# EAGLE design simple-se (EAGLE 6.1)

## Sheet 1 of 3
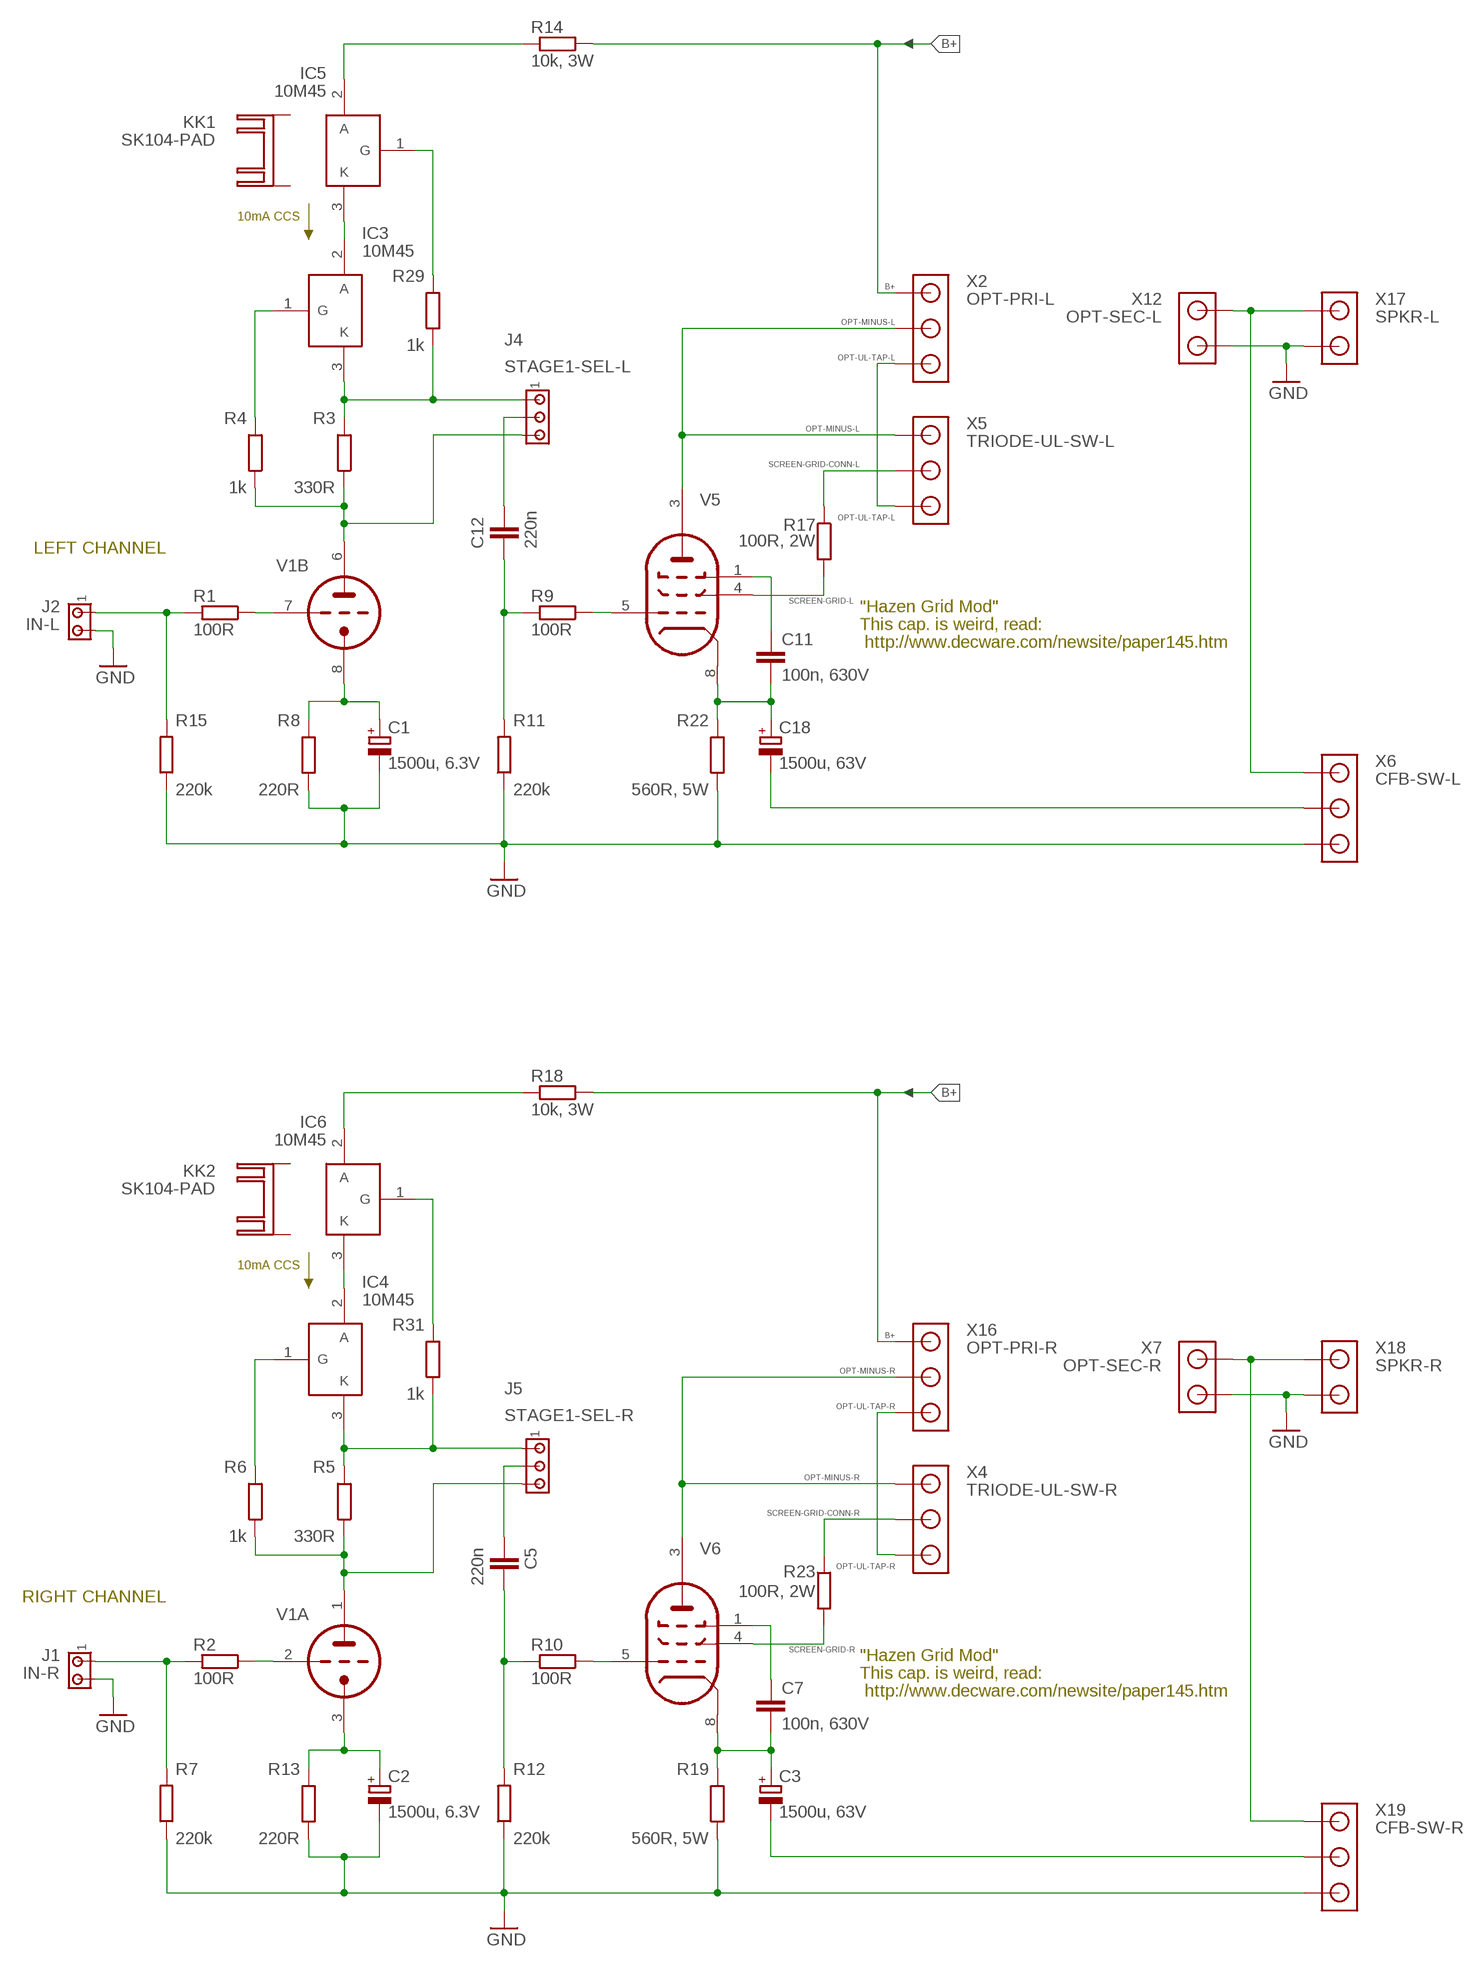
[diagram p0: schematic, sheet 1, part 1 of 2]
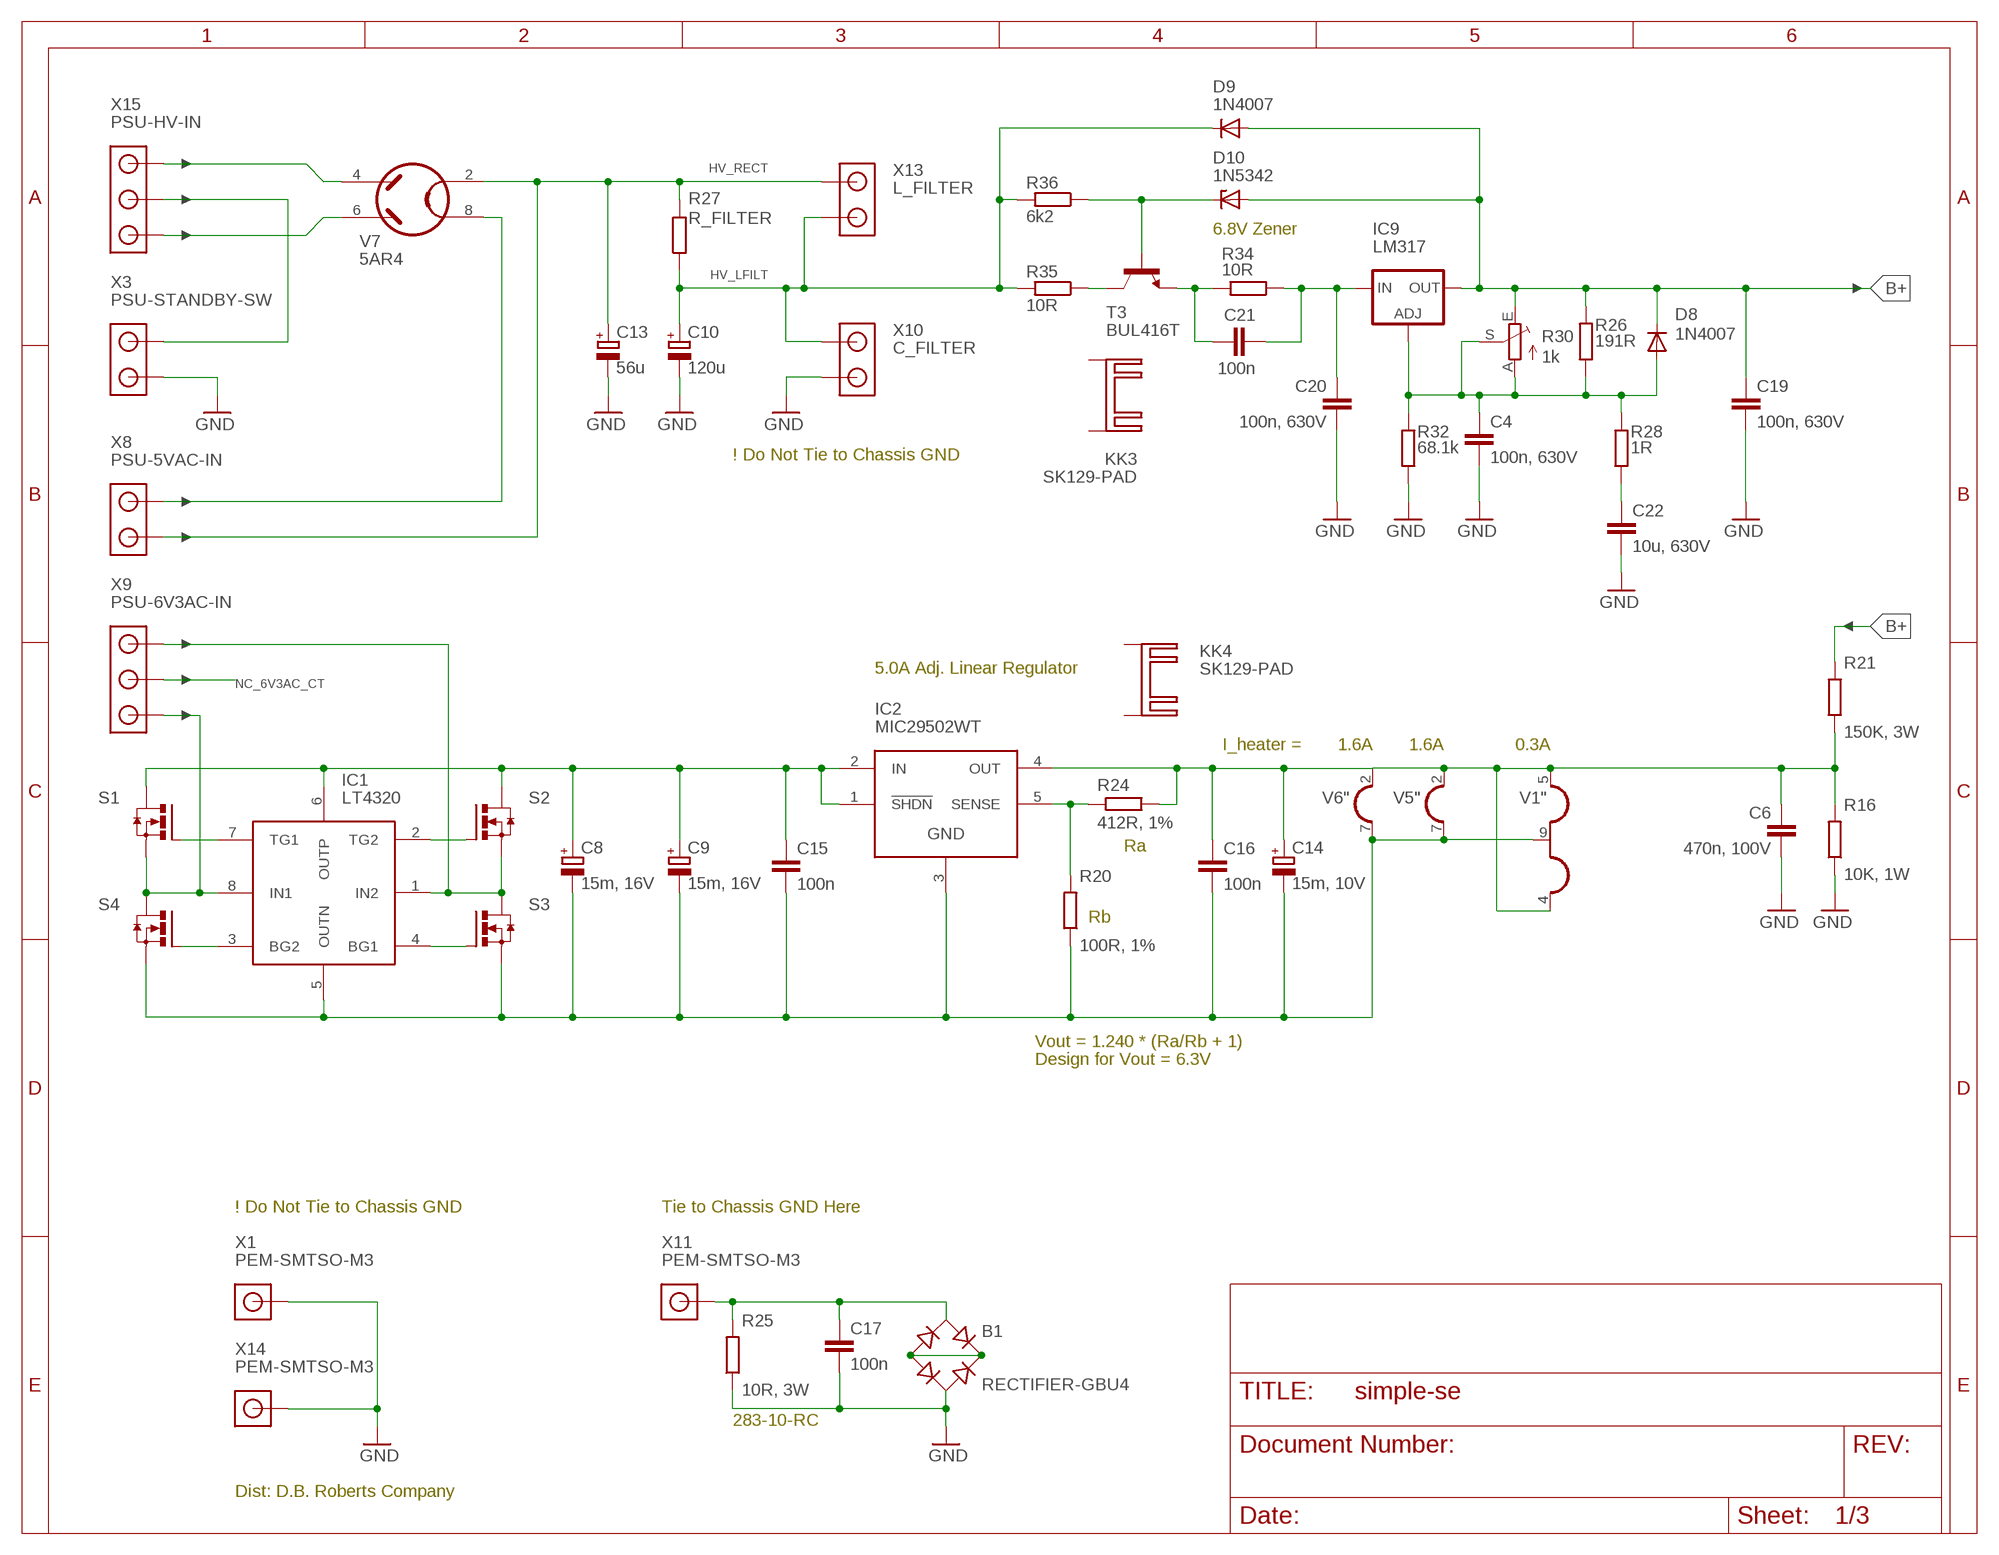
[diagram p1: schematic, sheet 1, part 2 of 2]

### Parts
B1  RECTIFIER-GBU4  [GBU4]
C1  1500u, 6.3V  CPOL-EUE5-10.5  [E5-10,5]
C2  1500u, 6.3V  CPOL-EUE5-10.5  [E5-10,5]
C3  1500u, 63V  CPOL-EUE5-13  [E5-13]
C4  100n, 630V  C-EU150-072X183  [C150-072X183]
C5  220n  C-EU275-113X316  [C275-113X316]
C6  470n, 100V  C-EU075-063X106  [C075-063X106]
C7  100n, 630V  C-EU150-072X183  [C150-072X183]
C8  15m, 16V  CPOL-EUE7.5-18  [E7,5-18]
C9  15m, 16V  CPOL-EUE7.5-18  [E7,5-18]
C10  120u  CPOL-EUE10-30  [EB30D]
C11  100n, 630V  C-EU150-072X183  [C150-072X183]
C12  220n  C-EU275-113X316  [C275-113X316]
C13  56u  CPOL-EUE10-22.5  [EB22,5D]
C14  15m, 10V  CPOL-EUE7.5-18  [E7,5-18]
C15  100n  C-EU050-055X075  [C050-055X075]
C16  100n  C-EU050-055X075  [C050-055X075]
C17  100n  C-EU102-043X133  [C102-043X133]
C18  1500u, 63V  CPOL-EUE5-13  [E5-13]
C19  100n, 630V  C-EU150-072X183  [C150-072X183]
C20  100n, 630V  C-EU150-072X183  [C150-072X183]
C21  100n  C-EU150-072X183  [C150-072X183]
C22  10u, 630V  C-EU150-072X183  [C150-072X183]
D8  1N4007  1N4004  [DO41-10]
D9  1N4007  1N4004  [DO41-10]
D10  1N5342  ZENER-DIODEDO35Z10  [DO35Z10]
IC1  LT4320  [DIL08]
IC2  MIC29502WT  [TO220-5]
IC3  10M45  10M45V  [TO220V]
IC4  10M45  10M45V  [TO220V]
IC5  10M45  10M45V  [TO220V]
IC6  10M45  10M45V  [TO220V]
IC9  LM317  LM317TS  [317TS]
J1  IN-R  MTA02-156  [1X2MTA]
J2  IN-L  MTA02-156  [1X2MTA]
J4  STAGE1-SEL-L  MTA03-156  [1X3MTA]
J5  STAGE1-SEL-R  MTA03-156  [1X3MTA]
KK1  SK104-PAD  [SK104-PAD]
KK2  SK104-PAD  [SK104-PAD]
KK3  SK129-PAD  [SK129]
KK4  SK129-PAD  [SK129]
R1  100R  R-EU_0309/12  [0309/12]
R2  100R  R-EU_0309/12  [0309/12]
R3  330R  R-EU_0309/12  [0309/12]
R4  1k  R-EU_0309/12  [0309/12]
R5  330R  R-EU_0309/12  [0309/12]
R6  1k  R-EU_0309/12  [0309/12]
R7  220k  R-EU_0309/12  [0309/12]
R8  220R  R-EU_0309/12  [0309/12]
R9  100R  R-EU_0309/12  [0309/12]
R10  100R  R-EU_0309/12  [0309/12]
R11  220k  R-EU_0309/12  [0309/12]
R12  220k  R-EU_0309/12  [0309/12]
R13  220R  R-EU_0309/12  [0309/12]
R14  10k, 3W  R-EU_0617/22  [0617/22]
R15  220k  R-EU_0309/12  [0309/12]
R16  10K, 1W  R-EU_0309/12  [0309/12]
R17  100R, 2W  R-EU_0411/12  [0411/12]
R18  10k, 3W  R-EU_0617/22  [0617/22]
R19  560R, 5W  R-EU_0922/22  [0922/22]
R20  100R, 1%  R-EU_0309/12  [0309/12]
R21  150K, 3W  R-EU_0617/22  [0617/22]
R22  560R, 5W  R-EU_0922/22  [0922/22]
R23  100R, 2W  R-EU_0411/12  [0411/12]
R24  412R, 1%  R-EU_0309/12  [0309/12]
R25  10R, 3W  R-EU_0617/17  [0617/17]
R26  191R  R-EU_0309/12  [0309/12]
R27  R_FILTER  R-EU_0922/22  [0922/22]
R28  1R  R-EU_0309/12  [0309/12]
R29  1k  R-EU_0309/12  [0309/12]
R30  1k  TRIM_EU-S64W  [S64W]
R31  1k  R-EU_0309/12  [0309/12]
R32  68.1k  R-EU_0309/12  [0309/12]
R34  10R  R-EU_0309/12  [0309/12]
R35  10R  R-EU_0309/12  [0309/12]
R36  6k2  R-EU_0309/12  [0309/12]
S1  MOSFET-N_DPAK  [DPAK]
S2  MOSFET-N_DPAK  [DPAK]
S3  MOSFET-N_DPAK  [DPAK]
S4  MOSFET-N_DPAK  [DPAK]
T3  BUL416T  -NPN-TO220V  [TO220V]
V1  12AT7-P  [NOVAL]
V5  EL34-P  [OKTAL]
V6  EL34-P  [OKTAL]
V7  5AR4  GZ34  [OKTAL]
X1  PEM-SMTSO-M3  [SMTSO-M3]
X2  OPT-PRI-L  MOLEX-SPOX-5281-3POS  [MOLEX-SPOX-5281-3POS]
X3  PSU-STANDBY-SW  MOLEX-SPOX-5281-2POS  [MOLEX-SPOX-5281-2POS]
X4  TRIODE-UL-SW-R  MOLEX-SPOX-5281-3POS  [MOLEX-SPOX-5281-3POS]
X5  TRIODE-UL-SW-L  MOLEX-SPOX-5281-3POS  [MOLEX-SPOX-5281-3POS]
X6  CFB-SW-L  MOLEX-SPOX-5281-3POS  [MOLEX-SPOX-5281-3POS]
X7  OPT-SEC-R  MOLEX-SPOX-5281-2POS  [MOLEX-SPOX-5281-2POS]
X8  PSU-5VAC-IN  MOLEX-SPOX-5281-2POS  [MOLEX-SPOX-5281-2POS]
X9  PSU-6V3AC-IN  MOLEX-SPOX-5281-3POS  [MOLEX-SPOX-5281-3POS]
X10  C_FILTER  MOLEX-SPOX-5281-2POS  [MOLEX-SPOX-5281-2POS]
X11  PEM-SMTSO-M3  [SMTSO-M3]
X12  OPT-SEC-L  MOLEX-SPOX-5281-2POS  [MOLEX-SPOX-5281-2POS]
X13  L_FILTER  MOLEX-SPOX-5281-2POS  [MOLEX-SPOX-5281-2POS]
X14  PEM-SMTSO-M3  [SMTSO-M3]
X15  PSU-HV-IN  MOLEX-SPOX-5281-3POS  [MOLEX-SPOX-5281-3POS]
X16  OPT-PRI-R  MOLEX-SPOX-5281-3POS  [MOLEX-SPOX-5281-3POS]
X17  SPKR-L  MOLEX-SPOX-5281-2POS  [MOLEX-SPOX-5281-2POS]
X18  SPKR-R  MOLEX-SPOX-5281-2POS  [MOLEX-SPOX-5281-2POS]
X19  CFB-SW-R  MOLEX-SPOX-5281-3POS  [MOLEX-SPOX-5281-3POS]

### Nets
B+: C19.1 D8.C D9.A D10.A IC9.2(OUT) R14.1 R18.1 R21.2 R26.2 R30.E X2.P$1 X16.P$1
GND: B1.AC2 C1.- C2.- C4.2 C6.2 C10.- C13.- C17.2 C19.2 C20.2 C22.2 J1.2 J2.2 R7.1 R8.1 R11.1 R12.1 R13.1 R15.1 R16.1 R19.1 R22.1 R25.1 R32.1 X1.P$1 X3.P$2 X6.P$3 X7.P$2 X10.P$2 X12.P$2 X14.P$1 X17.P$2 X18.P$2 X19.P$3
HV_LFILT: C10.+ D9.C R27.1 R35.2 R36.2 X10.P$1 X13.P$2
HV_RECT: C13.+ R27.2 V7.2(H1) X8.P$2 X13.P$1
N$1: R1.1 V1.7(B:TG)
N$2: J4.3 R3.1 R4.1 V1.6(B:TA)
N$3: R2.1 V1.2(A:TG)
N$4: J5.3 R5.1 R6.1 V1.1(A:TA)
N$5: IC4.3(K) J5.1 R5.2 R31.1
N$6: IC4.1(G) R6.2
N$7: IC3.3(K) J4.1 R3.2 R29.1
N$8: IC3.1(G) R4.2
N$9: J1.1 R2.2 R7.2
N$10: J2.1 R1.2 R15.2
N$11: R9.1 V5.5(PG)
N$12: B1.+ B1.-
N$13: C5.2 R10.2 R12.2
N$14: C12.1 R9.2 R11.2
N$15: C1.+ R8.2 V1.8(B:TK)
N$16: C2.+ R13.2 V1.3(A:TK)
N$17: IC6.2(A) R18.2
N$18: IC3.2(A) IC5.3(K)
N$19: C18.- X6.P$2
N$20: R10.1 V6.5(PG)
N$21: B1.AC1 C17.1 R25.2 X11.P$1
N$22: X3.P$1 X15.P$2
N$23: X6.P$1 X12.P$1 X17.P$1
N$24: R35.1 T3.2(C)
N$25: C4.1 D8.A IC9.1(ADJ) R26.1 R28.2 R30.A R30.S R32.2
N$26: V7.4(A1) X15.P$1
N$27: IC1.7(TG1) S1.1(G)
N$28: C21.1 R34.2 T3.3(E)
N$29: C20.1 C21.2 IC9.3(IN) R34.1
N$30: C11.2 C18.+ R22.2 V5.8(PK)
N$31: C7.1 V6.1(PBG)
N$32: C3.+ C7.2 R19.2 V6.8(PK)
N$33: V7.6(A2) X15.P$3
N$34: IC1.8(IN1) S1.3(S) S4.4(D) X9.P$3
N$35: V7.8(H2) X8.P$1
N$36: X19.P$2
N$37: X7.P$1 X18.P$1 X19.P$1
N$38: C22.1 R28.1
N$39: C11.1 V5.1(PBG)
N$40: C3.-
N$41: C8.+ C9.+ C15.1 IC1.6(OUTP) IC2.1(!SHDN) IC2.2(IN) S1.4(D) S2.4(D)
N$42: IC1.3(BG2) S4.1(G)
N$43: IC1.2(TG2) S2.1(G)
N$44: IC1.1(IN2) S2.3(S) S3.4(D) X9.P$1
N$45: IC1.4(BG1) S3.1(G)
N$46: C8.- C9.- C14.- C15.2 C16.2 IC1.5(OUTN) IC2.3(GND) R20.1 S3.3(S) S4.3(S) V1.9(":H2) V5.7(H2) V6.7(H2)
N$47: C6.1 C14.+ C16.1 IC2.4(OUT) R16.2 R21.1 R24.1 V1.4(":H1) V1.5(":H3) V5.2(H1) V6.2(H1)
N$48: D10.C R36.1 T3.1(B)
N$49: IC2.5(SENSE) R20.2 R24.2
N$50: IC5.1(G) R29.2
N$51: IC5.2(A) R14.2
N$52: C12.2 J4.2
N$53: IC4.2(A) IC6.3(K)
N$54: IC6.1(G) R31.2
N$55: C5.1 J5.2
NC_6V3AC_CT: X9.P$2
OPT-MINUS-L: V5.3(PA) X2.P$2 X5.P$1
OPT-MINUS-R: V6.3(PA) X4.P$1 X16.P$2
OPT-UL-TAP-L: X2.P$3 X5.P$3
OPT-UL-TAP-R: X4.P$3 X16.P$3
SCREEN-GRID-CONN-L: R17.1 X5.P$2
SCREEN-GRID-CONN-R: R23.1 X4.P$2
SCREEN-GRID-L: R17.2 V5.4(PSG)
SCREEN-GRID-R: R23.2 V6.4(PSG)
Unconnected: KK1.K1(K) KK1.K2(K) KK2.K1(K) KK2.K2(K) KK3.A2,5(K) KK3.B2,5(K) KK4.A2,5(K) KK4.B2,5(K)

### Notes on the sheet
- 10mA CCS
- 6.8V Zener
- LEFT CHANNEL
- ! Do Not Tie to Chassis GND
- "Hazen Grid Mod"
- This cap. is weird, read:
- http://www.decware.com/newsite/paper145.htm
- 5.0A Adj. Linear Regulator
- I_heater = | 1.6A | 1.6A | 0.3A
- Ra
- Rb
- Vout = 1.240 * (Ra/Rb + 1)
- Design for Vout = 6.3V
- 10mA CCS
- ! Do Not Tie to Chassis GND | Tie to Chassis GND Here
- 283-10-RC
- RIGHT CHANNEL
- Dist: D.B. Roberts Company
- "Hazen Grid Mod"
- This cap. is weird, read:
- http://www.decware.com/newsite/paper145.htm

## Sheet 2 of 3
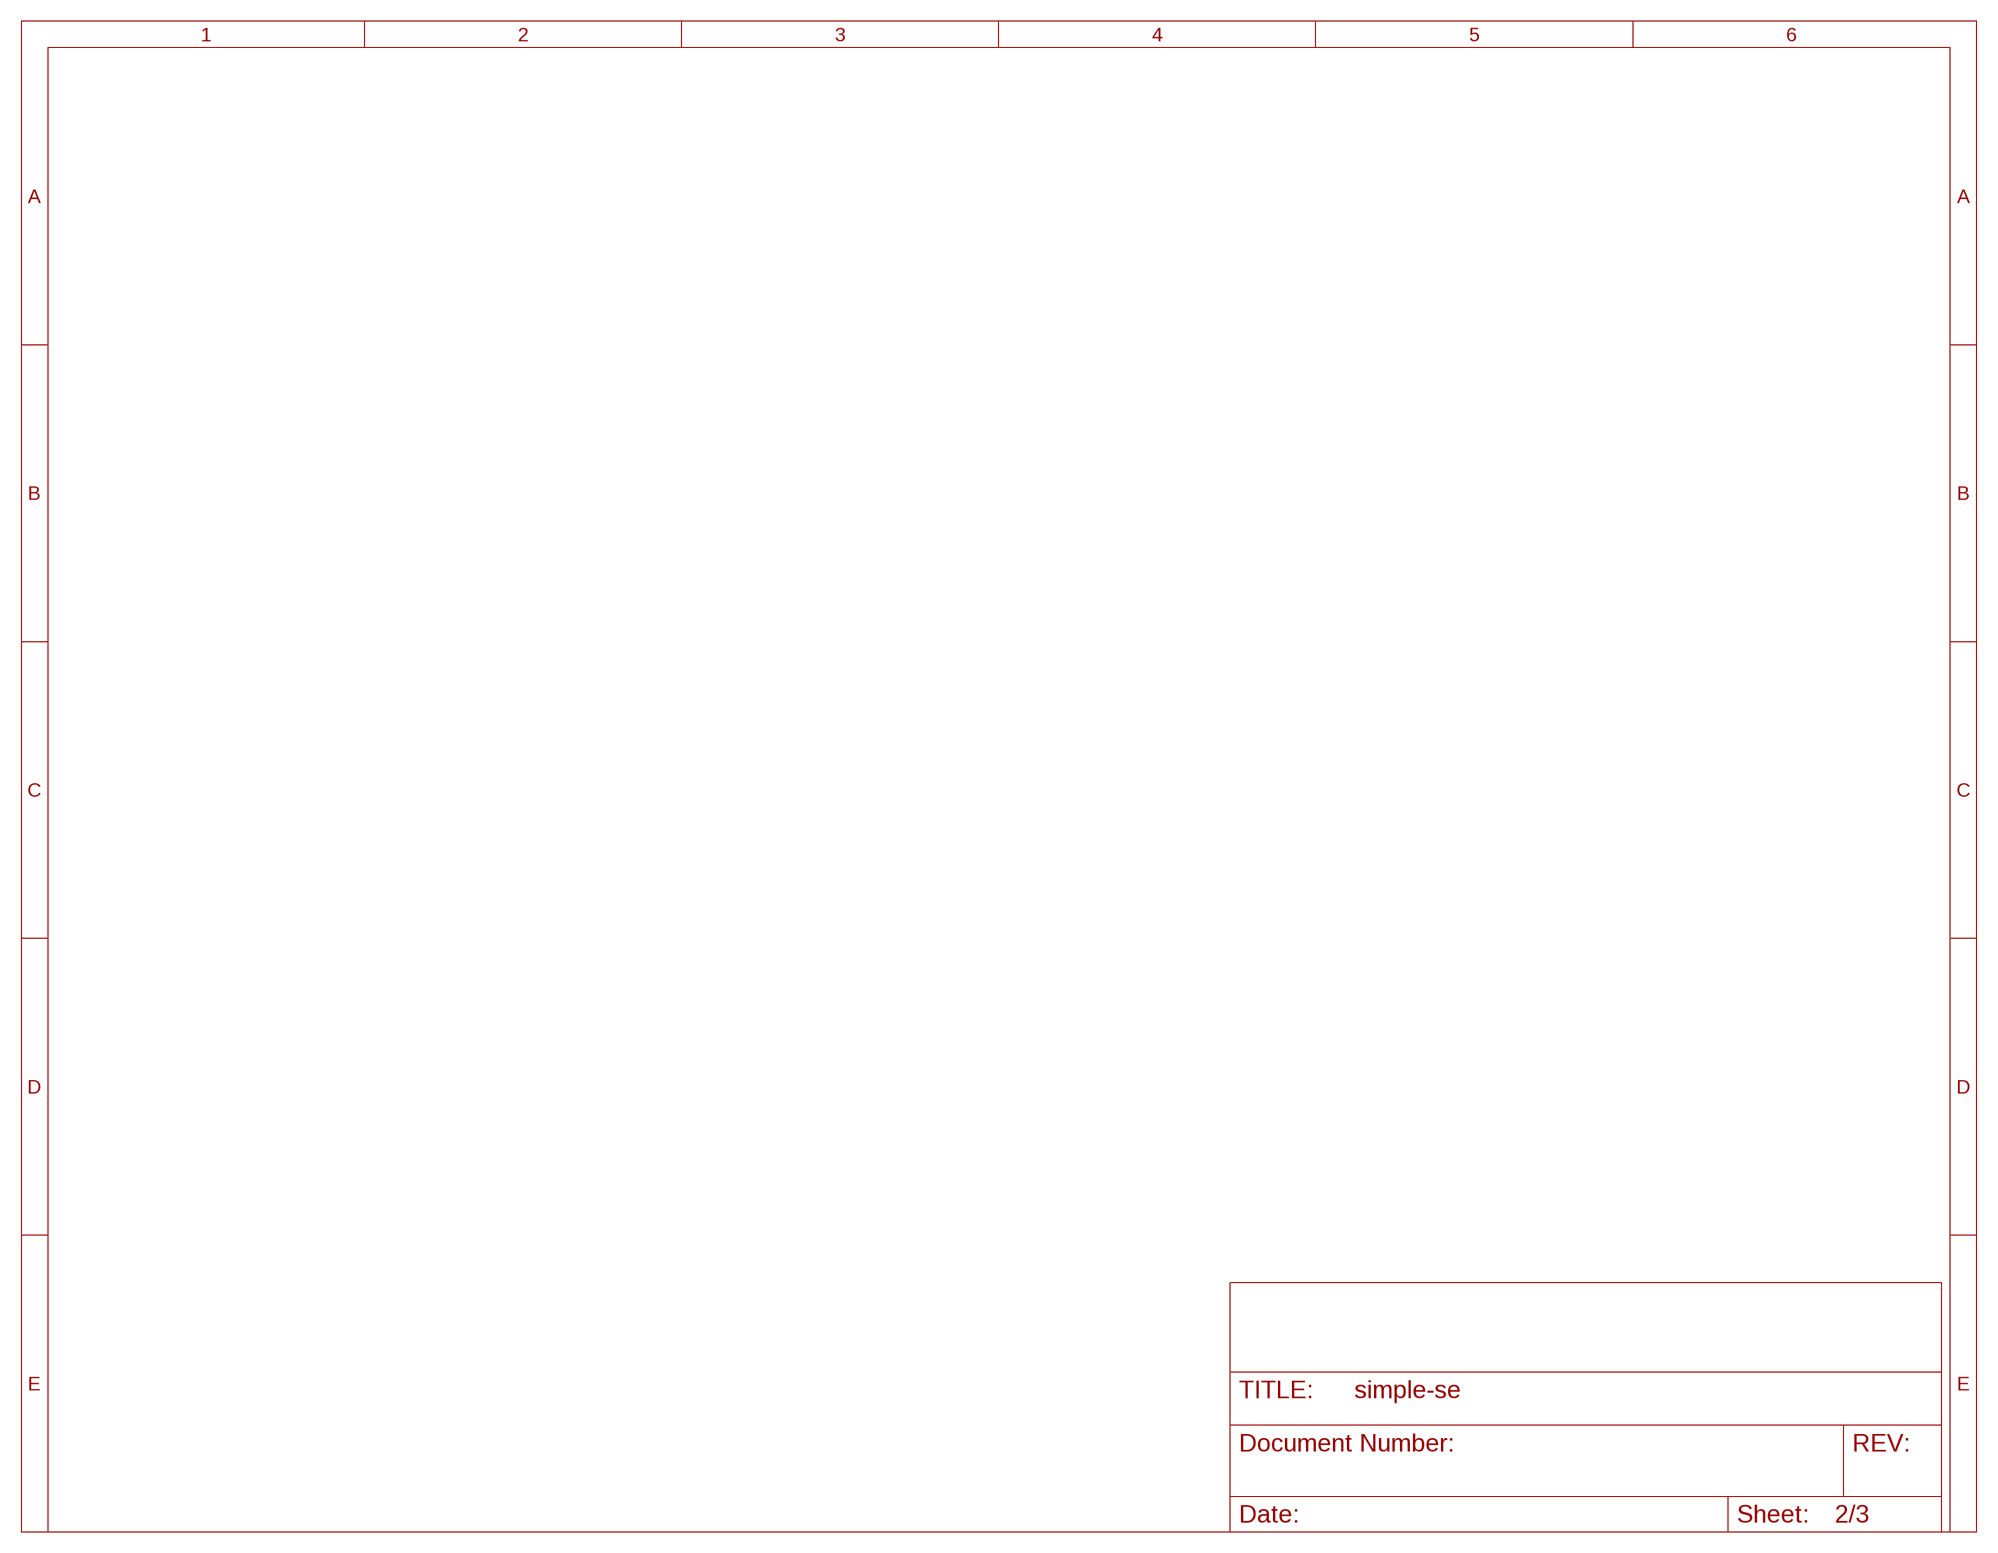
[diagram p2: schematic, sheet 2]

## Sheet 3 of 3
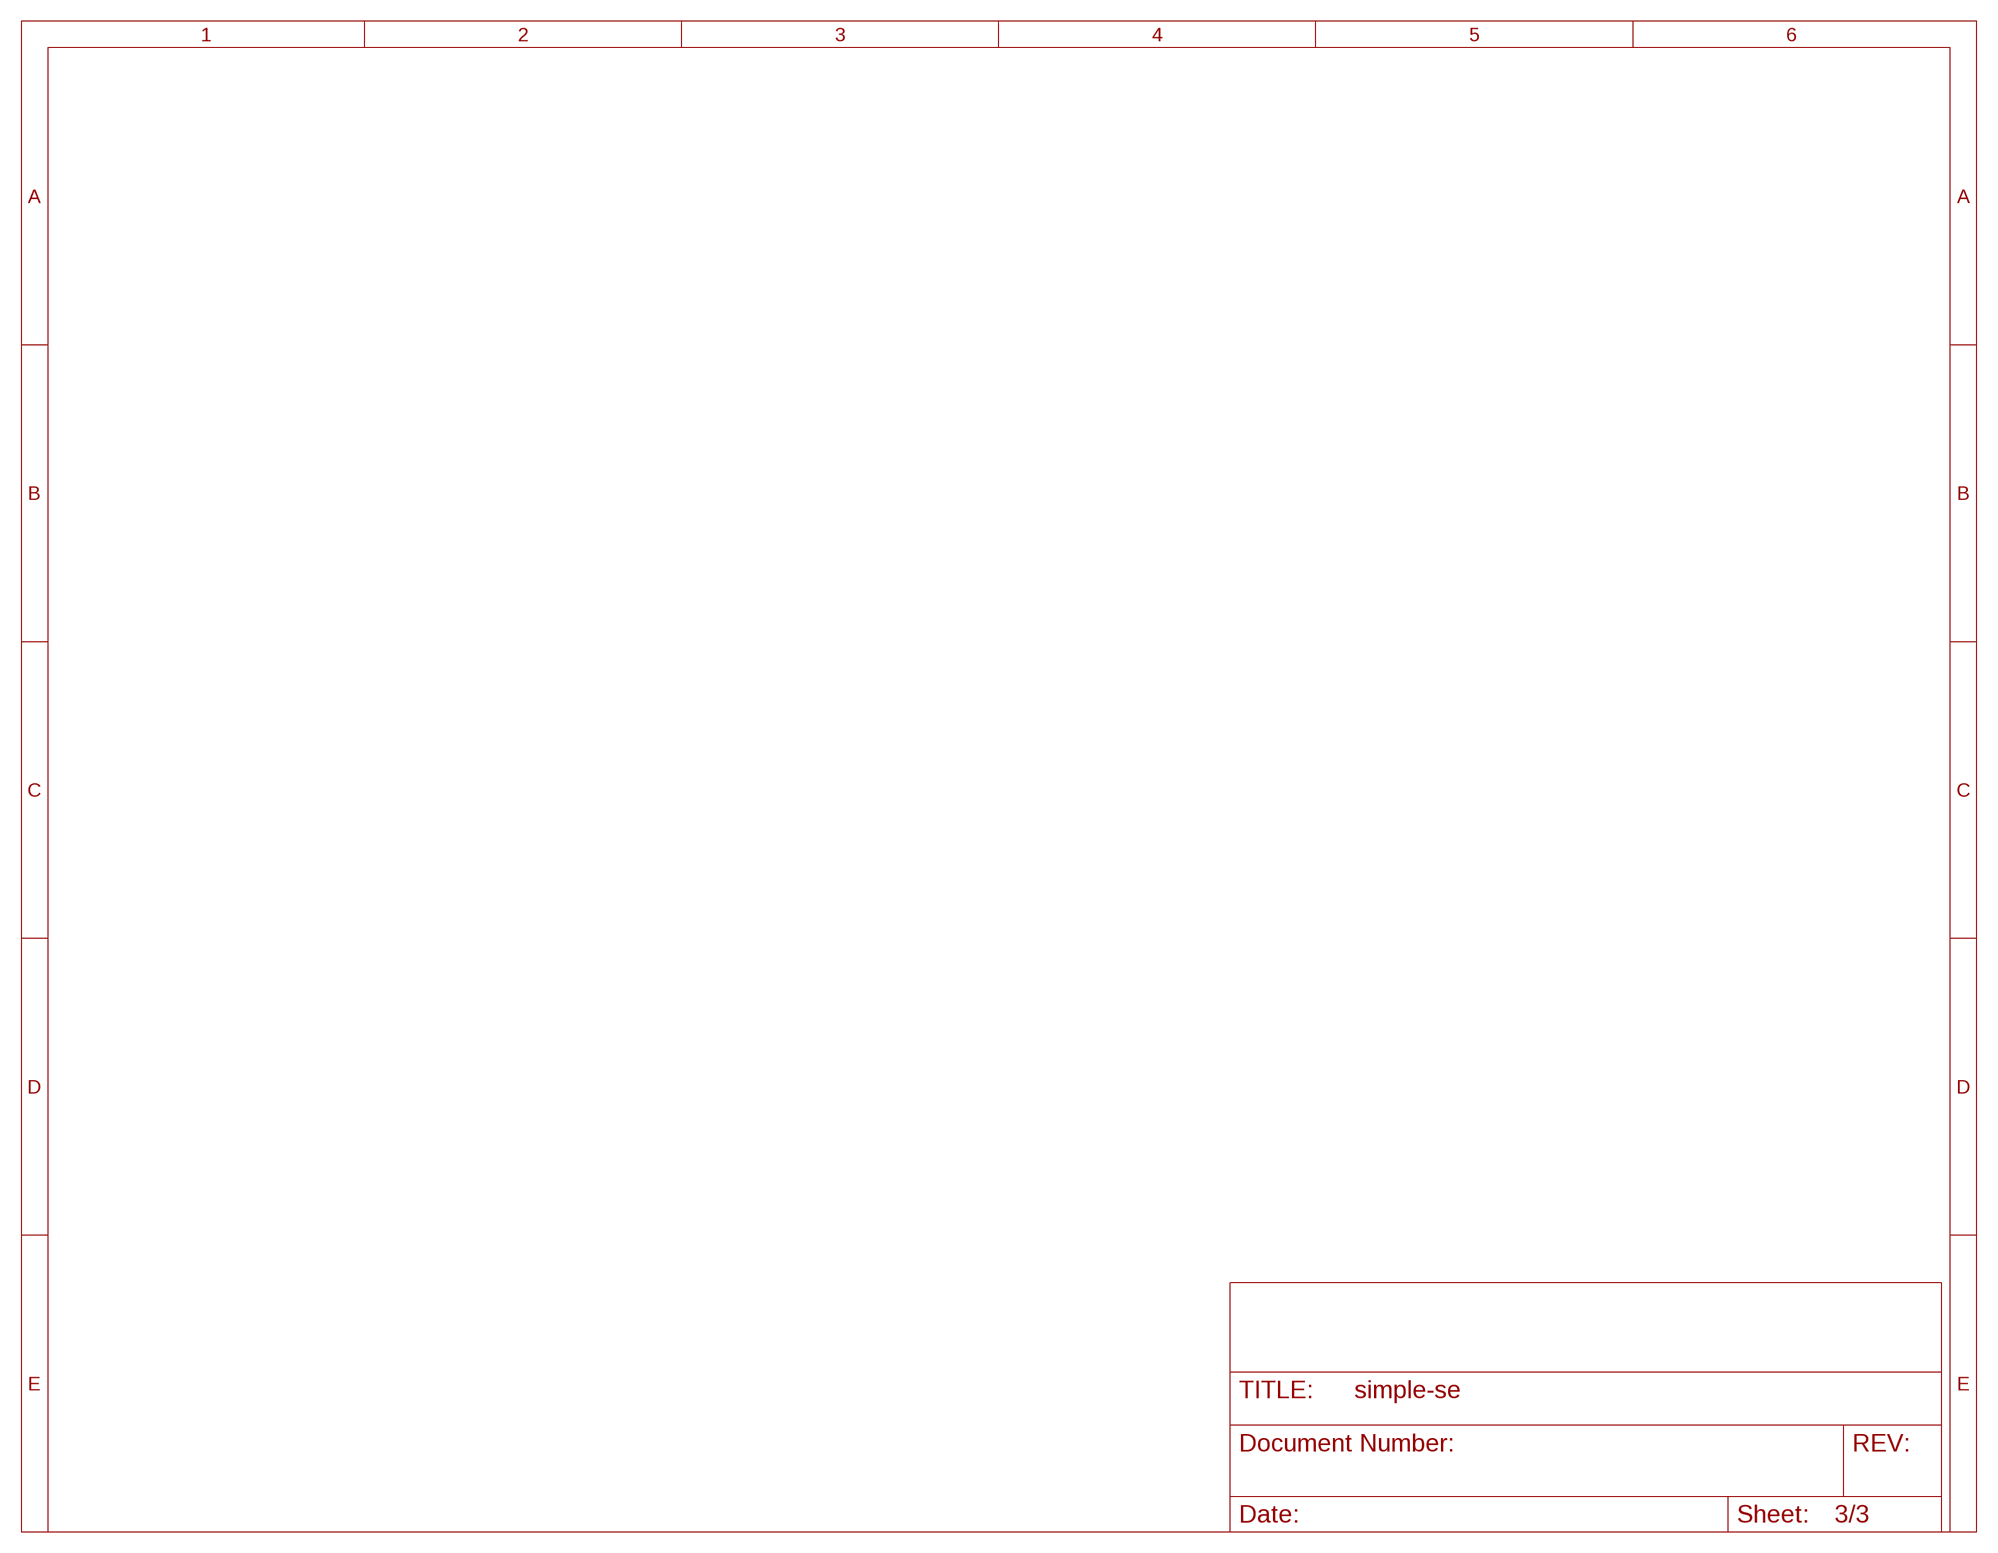
[diagram p3: schematic, sheet 3]

## Library data of the parts
B1 = rectifier:RECTIFIER-: Rectifier
C1-C3 C8-C10 C13 C14 C18 = rcl:CPOL-EU: POLARIZED CAPACITOR, European symbol
C4-C7 C11 C12 C15-C17 C19-C22 = rcl:C-EU: CAPACITOR, European symbol
D8 D9 = diode:1N4004: DIODE general purpose rectifier, 1 A
D10 = diode:ZENER-DIODE: Z-Diode
IC1 = simple-se:LT4320
IC2 = Kramnik's Library:MIC29502WT
IC3-IC6 = simple-se:10M45: 10M45 CCS IC
IC9 = v-reg:LM317TS: VOLTAGE REGULATOR
J1 J2 = con-amp:MTA02-156: AMP connector
J4 J5 = con-amp:MTA03-156: AMP connector
KK1 KK2 = heatsink:SK104-PAD: HEATSINK manufacturer Fischer/distributor Buerklin
KK3 KK4 = heatsink:SK129-PAD: HEATSINK manufacturer Fischer/distributor Buerklin
R1-R29 R31 R32 R34-R36 = rcl:R-EU_: RESISTOR, European symbol
R30 = pot:TRIM_EU-: POTENTIOMETER
S1-S4 = sc_usercreated:MOSFET-N_DPAK
T3 = transistor:*-NPN-: NPN Transistror BF959 corrected 2008.03.06
V1 = Kramnik's Library:12AT7-P
V5 V6 = Kramnik's Library:EL34-P
V7 = Kramnik's Library:GZ34
X1 X11 X14 = simple-se:PEM-SMTSO
X2 X4-X6 X9 X15 X16 X19 = simple-se:MOLEX-SPOX-5281-3POS
X3 X7 X8 X10 X12 X13 X17 X18 = simple-se:MOLEX-SPOX-5281-2POS

## Board
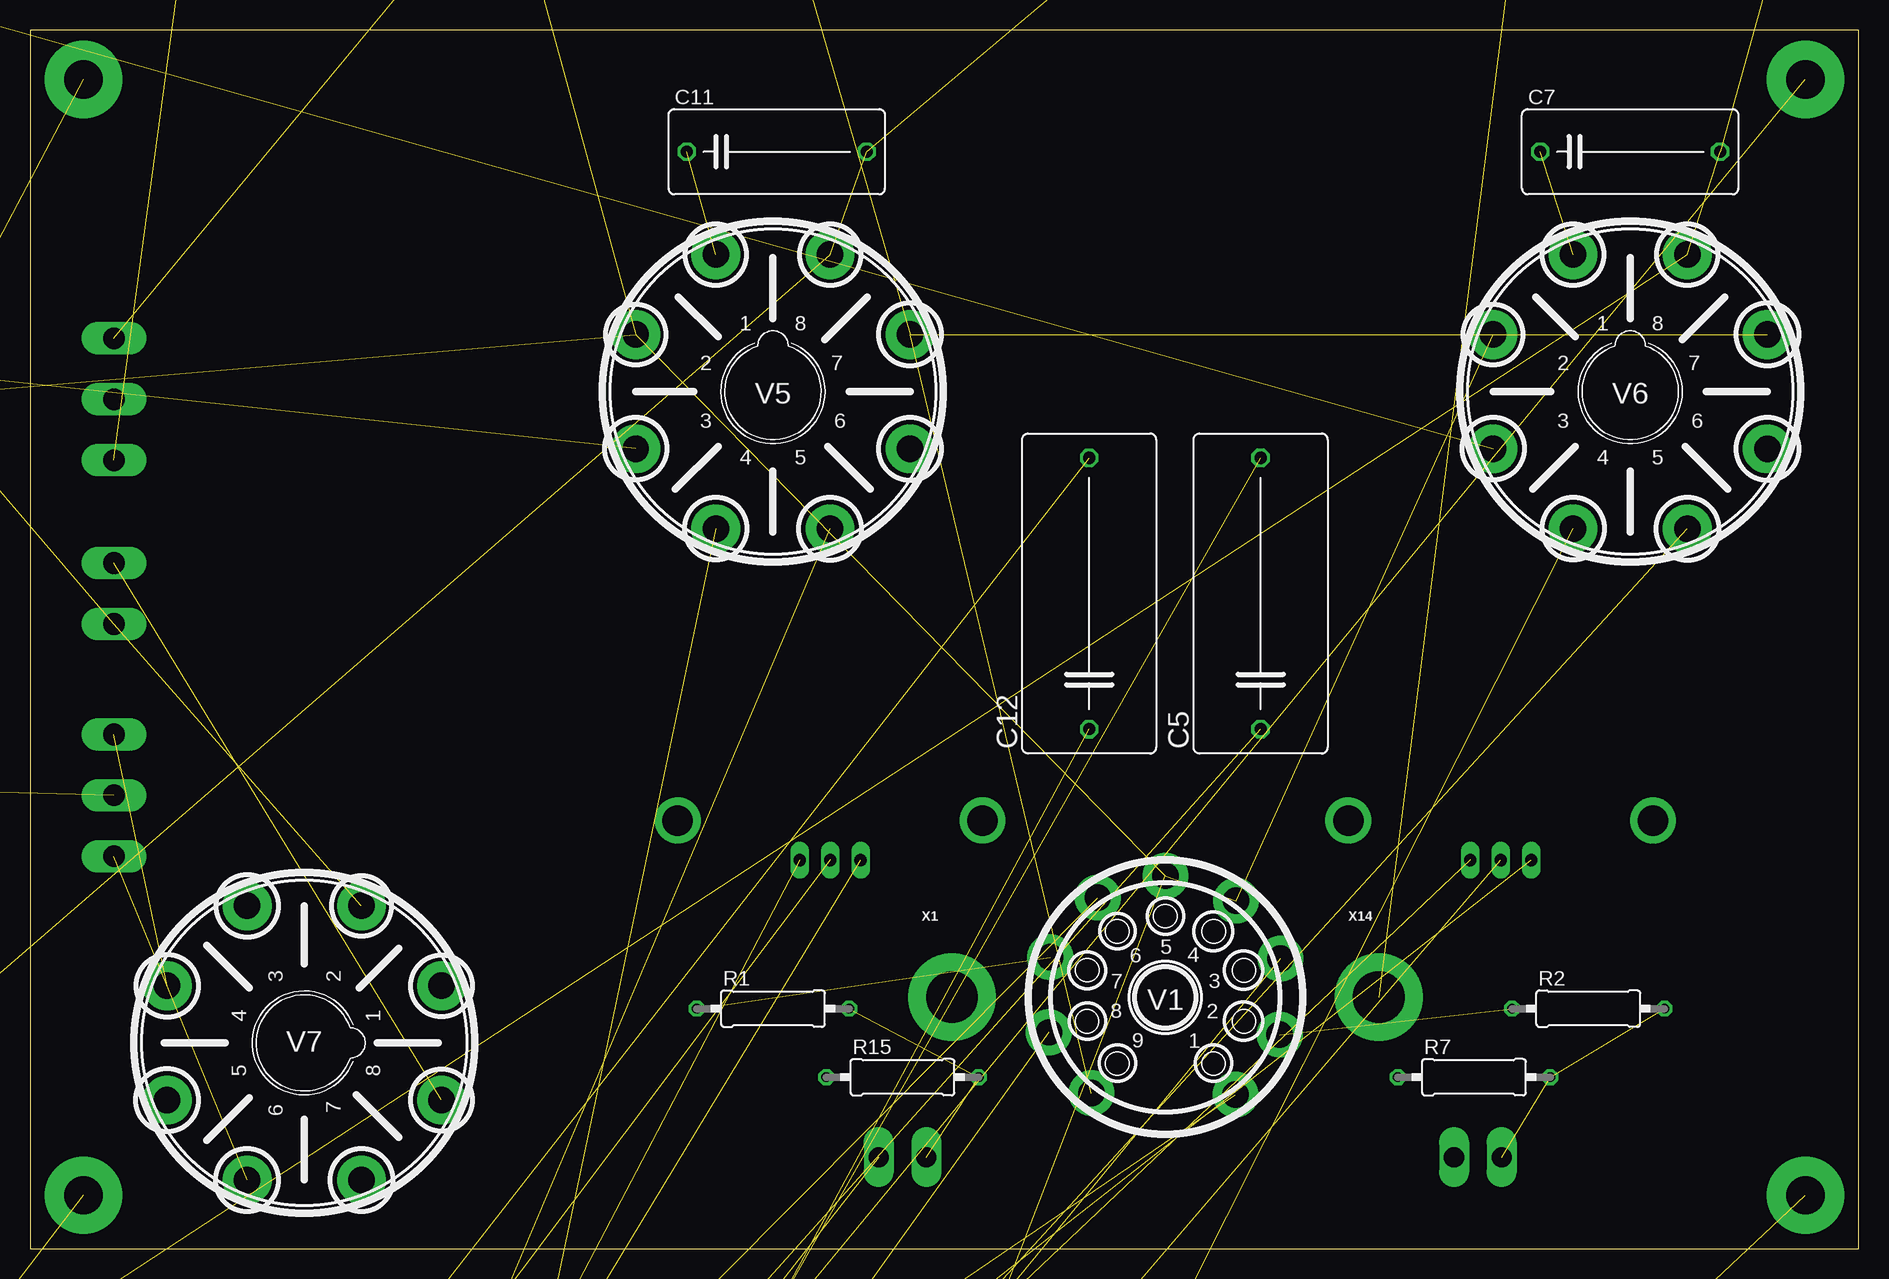
[diagram p4: board, top side]
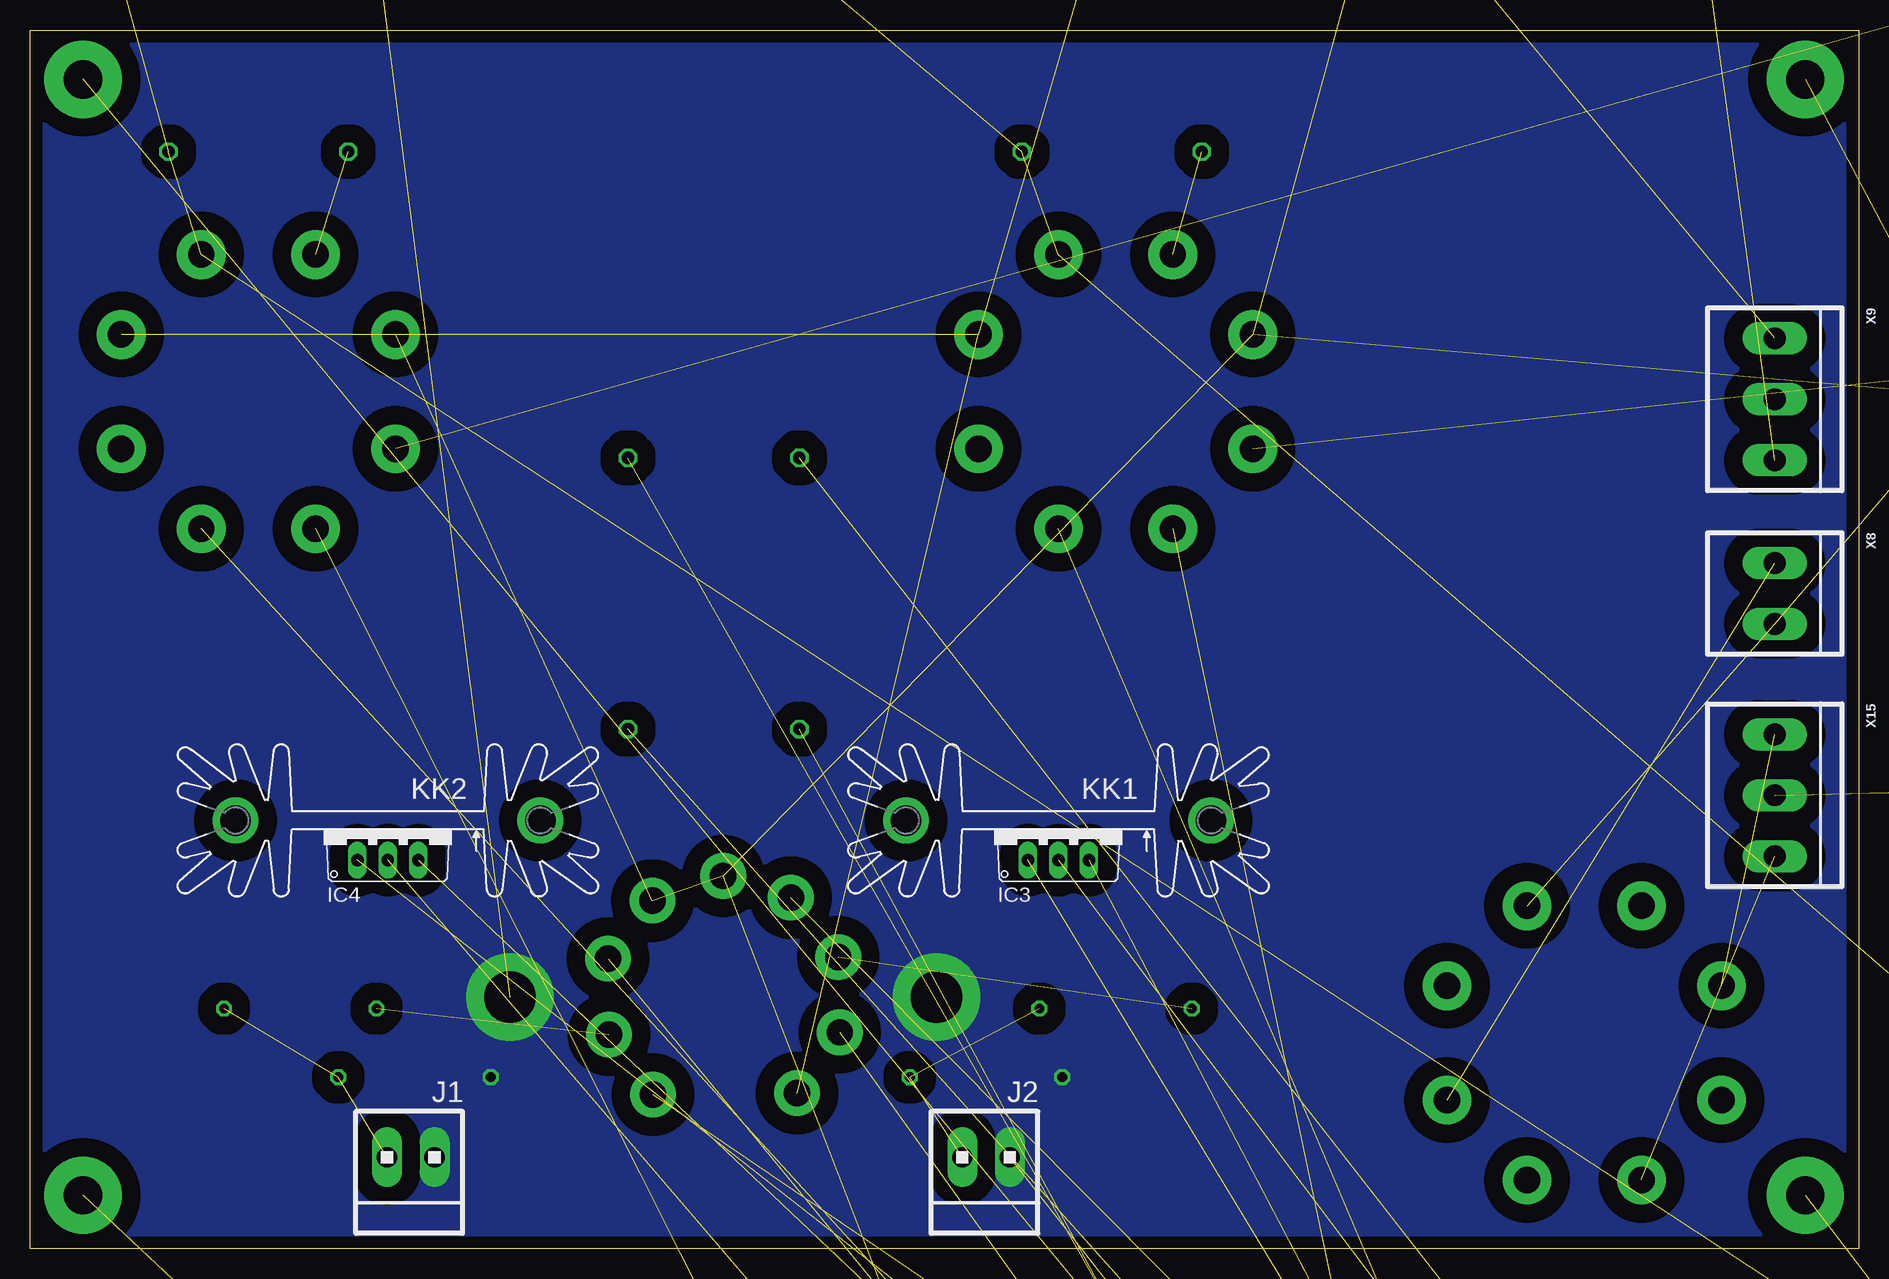
[diagram p5: board, bottom side, seen from below]

Size 152.38 x 101.59 mm. Coordinates in mm from the lower left corner, seen from the top.
Outline: 0,0 152.38,0 152.38,101.59 0,101.59 0,0
Copper layers (1*16): Top 0.035mm / dielectric 1.5mm / Bottom 0.035mm
Design rules: minimum track width 10mil, minimum drill 24mil, track to track 60mil, track to pad 60mil, pad to pad 60mil, via to via 60mil, smd to smd 60mil, copper to edge 40mil, drill to drill 8mil, minimum pad ring 10mil, minimum via ring 8mil, stop-mask expansion 4mil, vias tented up to drill 0mil, thermal gap 10mil

### Footprints (pad centres in the part's own frame; a part is rotated, then mirrored left to right if it is on the bottom)
GBU4 = drill 1.499 long: + 7.62,0; - -7.62,0; AC1 2.54,0; AC2 -2.54,0
E5-10,5 = drill 1.016 pad 2.54: + -2.54,0 | drill 1.016 pad 2.54 octagon: - 2.54,0
E5-13 = drill 1.016 pad 2.54: + -2.54,0 | drill 1.016 pad 2.54 octagon: - 2.54,0
C150-072X183 = drill 1.016 octagon: 1 -7.493,0; 2 7.493,0
C225-113X268 = drill 1.016 octagon: 1 -11.303,0; 2 11.303,0
C075-063X106 = drill 0.914 octagon: 1 -3.81,0; 2 3.81,0
E7,5-18 = drill 1.016 pad 3.15: + -3.81,0 | drill 1.016 pad 3.15 octagon: - 3.81,0
EB30D = drill 2.007 pad 4.597: + -5.08,0 | drill 2.007 pad 4.597 octagon: - 5.08,0
EB22,5D = drill 2.007 pad 4.597: + -5.08,0 | drill 2.007 pad 4.597 octagon: - 5.08,0
C050-055X075 = drill 0.813 octagon: 1 -2.54,0; 2 2.54,0
C102-043X133 = drill 1.016 octagon: 1 -5.08,0; 2 5.08,0
DO41-10 = drill 1.118: A 5.08,0; C -5.08,0
DO35Z10 = drill 0.813 long: A 5.08,0; C -5.08,0
DIL08 = drill 0.813 long: 1 -3.81,-3.81; 2 -1.27,-3.81; 3 1.27,-3.81; 4 3.81,-3.81; 5 3.81,3.81; 6 1.27,3.81; 7 -1.27,3.81; 8 -3.81,3.81
TO220-5 = drill 0.9 long: 1 -3.4,-8.4; 2 -1.7,-4.5; 3 0,-8.4; 4 1.7,-4.5; 5 3.4,-8.4
TO220V = drill 1.016 long: 1 -2.54,-2.54; 2 0,-2.54; 3 2.54,-2.54
317TS = drill 1.016 long: 1 -2.54,-2.54; 2 0,-2.54; 3 2.54,-2.54
1X2MTA = drill 1.676 long: 1 1.981,0; 2 -1.981,0
1X3MTA = drill 1.676 long: 1 3.937,0; 2 -0.025,0; 3 -3.988,0
SK104-PAD = drill 2.54 pad 3.81: K1 -12.7,-0.762; K2 12.7,-0.762
SK129 = drill 2.54 pad 5.08: A2,5 -12.7,-0.889; B2,5 12.7,-0.889
0309/12 = drill 0.813 octagon: 1 -6.35,0; 2 6.35,0
0617/22 = drill 1.016 octagon: 1 -11.43,0; 2 11.43,0
0411/12 = drill 0.914 octagon: 1 -6.35,0; 2 6.35,0
0922/22 = drill 1.016 octagon: 1 -11.43,0; 2 11.43,0
0617/17 = drill 1.016 octagon: 1 -8.89,0; 2 8.89,0
S64W = drill 0.813 long: A 2.54,1.27; E -2.54,1.27; S 0,1.27
DPAK = smd 1 x 1.6: 1 -2.28,-4.8; 3 2.28,-4.8 | smd 5.4 x 6.2: 4 0,2.5
NOVAL = drill 2.2 pad 3.81: 1 5.842,-8.128; 2 9.524,-3.119; 3 9.591,3.211; 4 5.893,8.04; 5 0,10.111; 6 -5.639,8.294; 7 -9.591,3.337; 8 -9.714,-2.929; 9 -6.16,-8.001
OKTAL = drill 2.2 pad 4.064: 1 4.763,-11.43; 2 11.43,-4.763; 3 11.43,4.763; 4 4.763,11.43; 5 -4.763,11.43; 6 -11.43,4.763; 7 -11.43,-4.763; 8 -4.763,-11.43
SMTSO-M3 = drill 4.3 pad 7.3: P$1 0,0
MOLEX-SPOX-5281-3POS = drill 1.8 long: P$1 -5.08,0; P$2 0,0; P$3 5.08,0
MOLEX-SPOX-5281-2POS = drill 1.8 long: P$1 -2.54,0; P$2 2.54,0

### Placement (x,y rotation side)
B1  -76.2,0.64 0 top  (outside the outline)
C1  -118.11,-121.28 0 top  (outside the outline)
C2  -118.11,-110.49 0 top  (outside the outline)
C3  -116.2,-85.09 0 top  (outside the outline)
C4  -181.61,-249.56 0 top  (outside the outline)
C5  220n  [C225-113X268]  102.55,54.61 90 top
C6  -184.78,33.66 0 top  (outside the outline)
C7  133.35,91.44 0 top
C8  -101.6,99.69 0 top  (outside the outline)
C9  -101.6,81.28 0 top  (outside the outline)
C10  -43.81,146.69 0 top  (outside the outline)
C11  62.23,91.44 0 top
C12  220n  [C225-113X268]  88.27,54.61 90 top
C13  -43.81,117.47 0 top  (outside the outline)
C14  -101.6,62.87 0 top  (outside the outline)
C15  -104.78,48.26 0 top  (outside the outline)
C16  -106.05,40.01 0 top  (outside the outline)
C17  -72.39,19.68 180 top  (outside the outline)
C18  -107.95,-70.48 0 top  (outside the outline)
C19  -181.61,-259.08 0 top  (outside the outline)
C20  -181.61,-268.61 0 top  (outside the outline)
C21  -246.38,-363.22 0 top  (outside the outline)
C22  -246.38,-378.46 0 top  (outside the outline)
D8  -183.51,-223.52 0 top  (outside the outline)
D9  -170.81,-223.52 0 top  (outside the outline)
D10  -167.64,-229.87 0 top  (outside the outline)
IC1  57.15,114.94 0 top  (outside the outline)
IC2  31.11,148.59 180 top  (outside the outline)
IC3  66.67,34.92 0 bottom
IC4  122.56,34.92 0 bottom
IC5  -249.56,-382.27 0 top  (outside the outline)
IC6  -249.56,-396.24 0 top  (outside the outline)
IC9  -173.99,-211.46 0 top  (outside the outline)
J1  120.65,7.62 180 bottom
J2  72.71,7.62 180 bottom
J4  -235.59,-349.25 0 top  (outside the outline)
J5  -248.92,-349.25 0 top  (outside the outline)
KK1  66.67,34.92 180 bottom
KK2  122.56,34.92 180 bottom
KK3  -168.91,-284.48 0 top  (outside the outline)
KK4  31.11,148.59 0 top  (outside the outline)
R1  61.91,20 0 top
R2  129.86,20 0 top
R3  7.3,-63.82 0 top  (outside the outline)
R4  7.3,-59.37 0 top  (outside the outline)
R5  7.3,-68.26 0 top  (outside the outline)
R6  7.3,-54.93 0 top  (outside the outline)
R7  120.33,14.29 0 top
R8  7.3,-81.6 0 top  (outside the outline)
R9  7.3,-94.93 0 top  (outside the outline)
R10  7.3,-90.49 0 top  (outside the outline)
R11  7.3,-99.38 0 top  (outside the outline)
R12  7.3,-103.82 0 top  (outside the outline)
R13  7.3,-86.04 0 top  (outside the outline)
R14  7.3,-136.84 0 top  (outside the outline)
R15  72.71,14.29 0 top
R16  2.22,-183.83 0 top  (outside the outline)
R17  -2.86,-194.94 0 top  (outside the outline)
R18  7.3,-145.41 0 top  (outside the outline)
R19  135.57,113.67 0 top  (outside the outline)
R20  -102.87,33.66 0 top  (outside the outline)
R21  23.18,-183.51 0 top  (outside the outline)
R22  87.31,115.89 0 top  (outside the outline)
R23  -2.86,-188.59 0 top  (outside the outline)
R24  -102.87,29.21 0 top  (outside the outline)
R25  -72.39,12.06 0 top  (outside the outline)
R26  -183.51,-302.26 0 top  (outside the outline)
R27  -183.51,-307.98 0 top  (outside the outline)
R28  -247.65,-370.84 0 top  (outside the outline)
R29  -247.65,-394.33 0 top  (outside the outline)
R30  -184.78,-216.53 0 top  (outside the outline)
R31  -247.65,-408.31 0 top  (outside the outline)
R32  -183.51,-237.49 0 top  (outside the outline)
R34  -170.81,-237.49 0 top  (outside the outline)
R35  -183.51,-241.94 0 top  (outside the outline)
R36  -170.81,-241.94 0 top  (outside the outline)
S1  42.55,114.94 0 top  (outside the outline)
S2  33.02,114.94 0 top  (outside the outline)
S3  23.5,114.94 0 top  (outside the outline)
S4  13.97,114.94 0 top  (outside the outline)
T3  -162.56,-211.46 0 top  (outside the outline)
V1  94.61,20.95 0 top
V5  61.91,71.44 180 top
V6  133.35,71.44 180 top
V7  22.86,17.14 90 top
X1  76.83,20.95 0 top
X2  -136.53,86.68 0 top  (outside the outline)
X3  -183.51,42.86 0 top  (outside the outline)
X4  -79.38,125.09 0 top  (outside the outline)
X5  -169.86,42.86 0 top  (outside the outline)
X6  -210.19,-321.94 0 top  (outside the outline)
X7  -212.72,-351.15 0 top  (outside the outline)
X8  6.99,54.61 270 bottom
X9  6.99,70.8 270 bottom
X10  -161.29,57.47 0 top  (outside the outline)
X11  -56.52,12.06 0 top  (outside the outline)
X12  -201.29,-306.7 0 top  (outside the outline)
X13  -172.4,57.47 0 top  (outside the outline)
X14  112.39,20.95 0 top
X15  6.99,37.78 270 bottom
X16  -147.64,72.07 0 top  (outside the outline)
X17  -212.72,-306.7 0 top  (outside the outline)
X18  -201.29,-351.15 0 top  (outside the outline)
X19  -210.19,-336.55 0 top  (outside the outline)

### Tracks (layer width: path | path; a pad name or v marks a point on that pad's centre or on a via)
B+  (11 unrouted)
GND  (28 unrouted)
  pour Bottom (no thermals): 0,102.23 0,0 152.4,0 152.4,102.23
HV_LFILT  (6 unrouted)
HV_RECT  (4 unrouted)
N$1  (1 unrouted)
N$2  (3 unrouted)
N$3  (1 unrouted)
N$4  (3 unrouted)
N$5  (3 unrouted)
N$6  (1 unrouted)
N$7  (3 unrouted)
N$8  (1 unrouted)
N$9  (2 unrouted)
N$10  (2 unrouted)
N$11  (1 unrouted)
N$12  (1 unrouted)
N$13  (2 unrouted)
N$14  (2 unrouted)
N$15  (2 unrouted)
N$16  (2 unrouted)
N$17  (1 unrouted)
N$18  (1 unrouted)
N$19  (1 unrouted)
N$20  (1 unrouted)
N$21  (3 unrouted)
N$22  (1 unrouted)
N$23  (2 unrouted)
N$24  (via drill 3.2 pad 6.45)  (2 unrouted)
  other vias: 4.45,4.45
N$25  (7 unrouted)
N$26  (1 unrouted)
N$27  (1 unrouted)
N$28  (via drill 3.2 pad 6.45)  (3 unrouted)
  other vias: 4.45,97.47
N$29  (3 unrouted)
N$30  (3 unrouted)
N$31  (1 unrouted)
N$32  (3 unrouted)
N$33  (1 unrouted)
N$34  (3 unrouted)
N$35  (1 unrouted)
N$36  (via drill 3.2 pad 6.45)  (1 unrouted)
  other vias: 147.96,97.47
N$37  (via drill 3.2 pad 6.45)  (3 unrouted)
  other vias: 147.96,4.45
N$38  (1 unrouted)
N$39  (1 unrouted)
N$41  (7 unrouted)
N$42  (1 unrouted)
N$43  (1 unrouted)
N$44  (3 unrouted)
N$45  (1 unrouted)
N$46  (12 unrouted)
N$47  (10 unrouted)
N$48  (2 unrouted)
N$49  (2 unrouted)
N$50  (1 unrouted)
N$51  (1 unrouted)
N$52  (1 unrouted)
N$53  (1 unrouted)
N$54  (1 unrouted)
N$55  (1 unrouted)
OPT-MINUS-L  (2 unrouted)
OPT-MINUS-R  (2 unrouted)
OPT-UL-TAP-L  (1 unrouted)
OPT-UL-TAP-R  (1 unrouted)
SCREEN-GRID-CONN-L  (1 unrouted)
SCREEN-GRID-CONN-R  (1 unrouted)
SCREEN-GRID-L  (1 unrouted)
SCREEN-GRID-R  (1 unrouted)